# Altium schematic sheet Top.SchDoc
size A
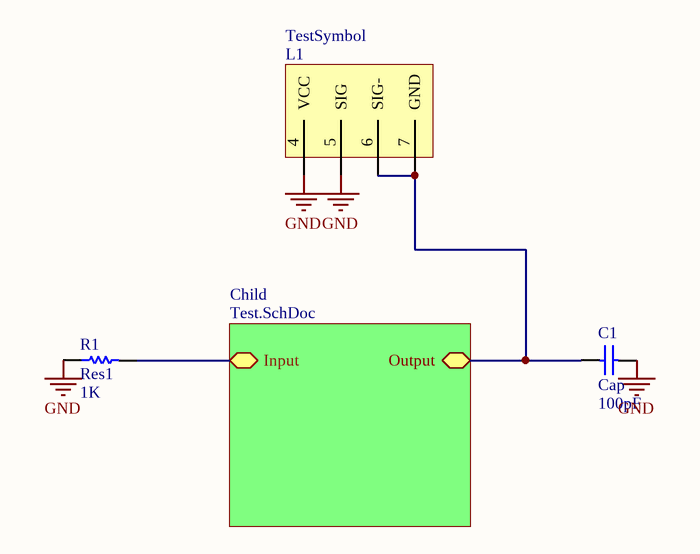
[diagram p0: Top.SchDoc]

## Parts
C1  Cap  value 100pF  [RAD-0.3]
L1  TestSymbol  [PCBComponent_1]
R1  Res1  value 1K  [AXIAL-0.3]

## Sub-sheets
Child = Test.SchDoc: Input (bidir), Output (bidir)

## Nets
GND: C1.2 L1.4(VCC) L1.5(SIG) R1.1
NetC1_1: C1.1 L1.6(SIG-) L1.7(GND) ; sheet Child/Output
NetR1_2: R1.2 ; sheet Child/Input

## Library data of the parts
C1 = Cap: Capacitor; Published: 8-Jun-2000; LatestRevisionDate: 17-Jul-2002; LatestRevisionNote: Re-released for DXP Platform.; PackageReference: RAD-0.3; Publisher: Altium Limited; PackageDescription: Radial Cap, Thru-Hole; 2 Leads; 0.3 in Pin Spacing
L1 = Dankness
R1 = Res1: Resistor; Published: 8-Jun-2000; LatestRevisionDate: 17-Jul-2002; LatestRevisionNote: Re-released for DXP Platform.; PackageReference: AXIAL-0.3; Publisher: Altium Limited; PackageDescription: Axial Device, Thru-Hole; 2 Leads; 0.3 in Pin Spacing